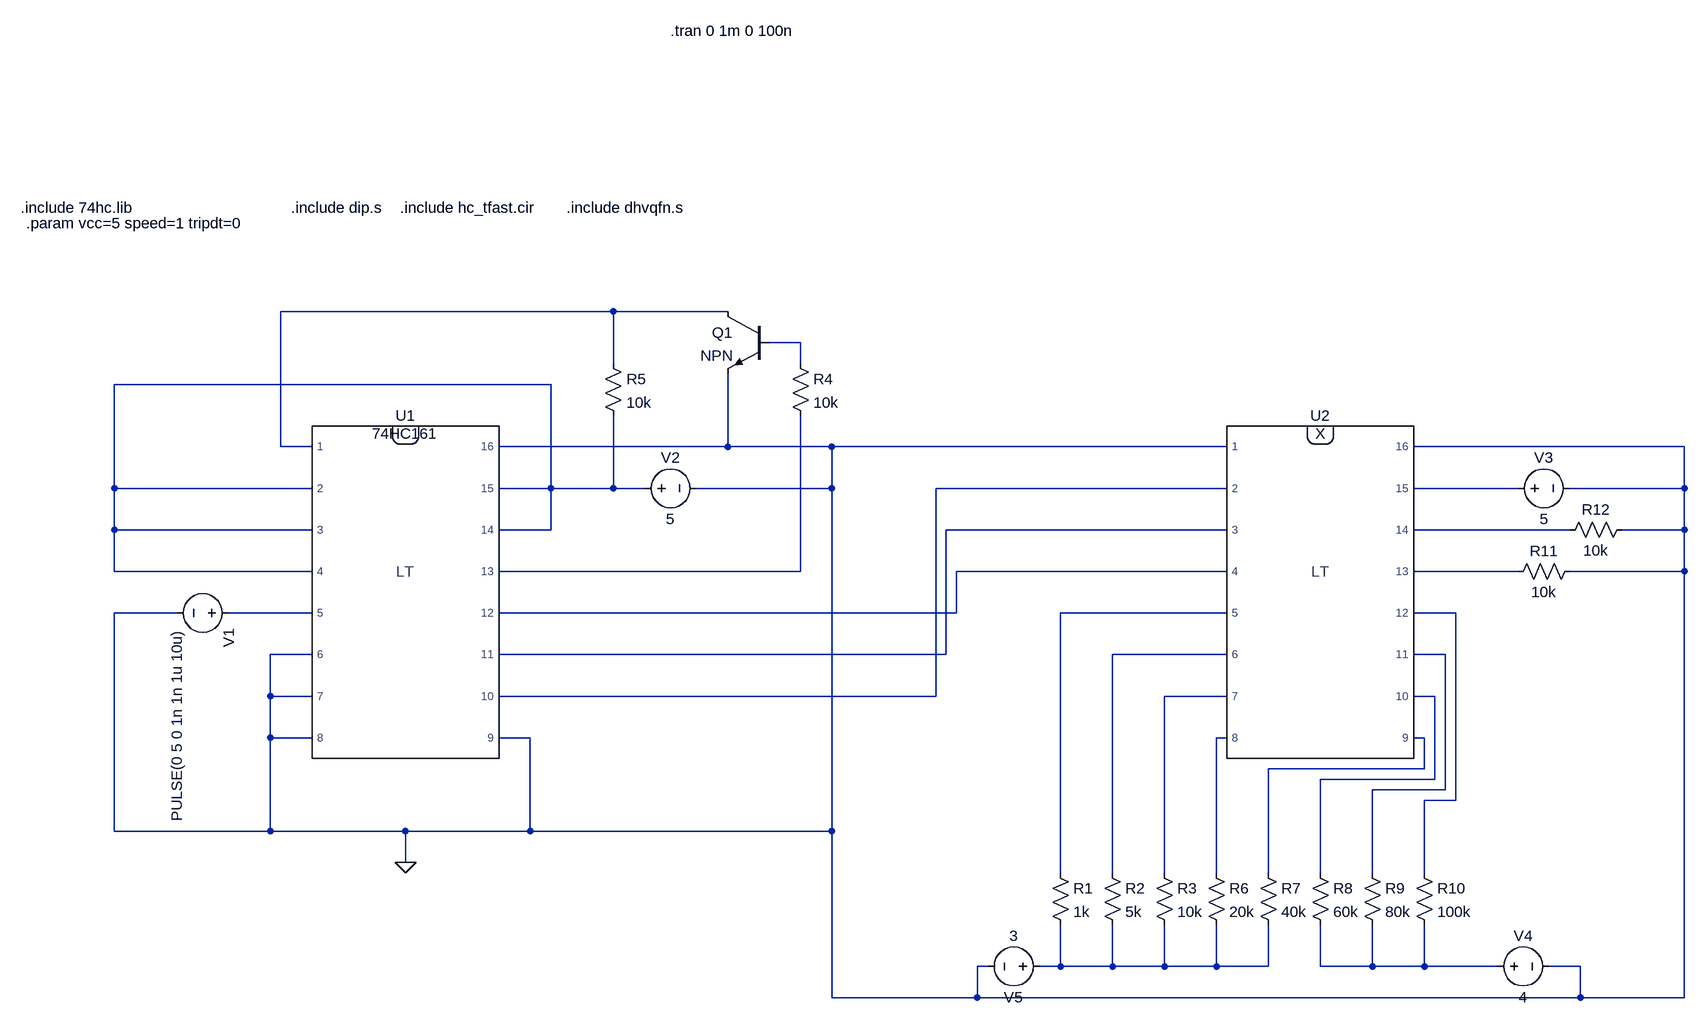
[diagram p0: schematic BinaryCounter.asc]
BinaryCounter.asc, the LTspice schematic file:
Version 4.1
SHEET 1 2248 848
WIRE 592 -224 80 -224
WIRE 768 -224 592 -224
WIRE 880 -176 832 -176
WIRE 592 -144 592 -224
WIRE 880 -144 880 -176
WIRE 496 -112 -176 -112
WIRE 80 -16 80 -224
WIRE 128 -16 80 -16
WIRE 768 -16 768 -128
WIRE 768 -16 416 -16
WIRE 928 -16 768 -16
WIRE 1536 -16 928 -16
WIRE 2240 -16 1824 -16
WIRE -176 48 -176 -112
WIRE 128 48 -176 48
WIRE 496 48 496 -112
WIRE 496 48 416 48
WIRE 592 48 592 -64
WIRE 592 48 496 48
WIRE 640 48 592 48
WIRE 928 48 928 -16
WIRE 928 48 720 48
WIRE 1536 48 1088 48
WIRE 1984 48 1824 48
WIRE 2240 48 2240 -16
WIRE 2240 48 2064 48
WIRE -176 112 -176 48
WIRE 128 112 -176 112
WIRE 496 112 496 48
WIRE 496 112 416 112
WIRE 1536 112 1104 112
WIRE 2064 112 1824 112
WIRE 2240 112 2240 48
WIRE 2240 112 2144 112
WIRE -176 176 -176 112
WIRE 128 176 -176 176
WIRE 880 176 880 -64
WIRE 880 176 416 176
WIRE 1536 176 1120 176
WIRE 1984 176 1824 176
WIRE 2240 176 2240 112
WIRE 2240 176 2064 176
WIRE -80 240 -176 240
WIRE 128 240 0 240
WIRE 1120 240 1120 176
WIRE 1120 240 416 240
WIRE 1536 240 1280 240
WIRE 1888 240 1824 240
WIRE 128 304 64 304
WIRE 1104 304 1104 112
WIRE 1104 304 416 304
WIRE 1536 304 1360 304
WIRE 1872 304 1824 304
WIRE 64 368 64 304
WIRE 128 368 64 368
WIRE 1088 368 1088 48
WIRE 1088 368 416 368
WIRE 1536 368 1440 368
WIRE 1856 368 1824 368
WIRE 64 432 64 368
WIRE 128 432 64 432
WIRE 464 432 416 432
WIRE 1536 432 1520 432
WIRE 1840 432 1824 432
WIRE 1840 480 1840 432
WIRE 1840 480 1600 480
WIRE 1856 496 1856 368
WIRE 1856 496 1680 496
WIRE 1872 512 1872 304
WIRE 1872 512 1760 512
WIRE 1888 528 1888 240
WIRE 1888 528 1840 528
WIRE -176 576 -176 240
WIRE 64 576 64 432
WIRE 64 576 -176 576
WIRE 272 576 64 576
WIRE 464 576 464 432
WIRE 464 576 272 576
WIRE 928 576 928 48
WIRE 928 576 464 576
WIRE 272 624 272 576
WIRE 1280 640 1280 240
WIRE 1360 640 1360 304
WIRE 1440 640 1440 368
WIRE 1520 640 1520 432
WIRE 1600 640 1600 480
WIRE 1680 640 1680 496
WIRE 1760 640 1760 512
WIRE 1840 640 1840 528
WIRE 1168 784 1152 784
WIRE 1280 784 1280 720
WIRE 1280 784 1248 784
WIRE 1360 784 1360 720
WIRE 1360 784 1280 784
WIRE 1440 784 1440 720
WIRE 1440 784 1360 784
WIRE 1520 784 1520 720
WIRE 1520 784 1440 784
WIRE 1600 784 1600 720
WIRE 1600 784 1520 784
WIRE 1680 784 1680 720
WIRE 1760 784 1760 720
WIRE 1760 784 1680 784
WIRE 1840 784 1840 720
WIRE 1840 784 1760 784
WIRE 1952 784 1840 784
WIRE 2080 784 2032 784
WIRE 928 832 928 576
WIRE 1152 832 1152 784
WIRE 1152 832 928 832
WIRE 2080 832 2080 784
WIRE 2080 832 1152 832
WIRE 2240 832 2240 176
WIRE 2240 832 2080 832
FLAG 272 624 0
SYMBOL Misc\\DIP16 272 80 R0
WINDOW 3 0 -116 Center 2
SYMATTR InstName U1
SYMATTR SpiceModel 74HC161
SYMATTR Value 74HC161
SYMBOL voltage 16 240 R90
WINDOW 123 0 0 Left 0
WINDOW 39 0 0 Left 0
SYMATTR InstName V1
SYMATTR Value PULSE(0 5 0 1n 1n 1u 10u)
SYMBOL voltage 624 48 R270
WINDOW 0 32 56 VTop 2
WINDOW 3 -32 56 VBottom 2
WINDOW 123 0 0 Left 0
WINDOW 39 0 0 Left 0
SYMATTR InstName V2
SYMATTR Value 5
SYMBOL npn 832 -224 M0
SYMATTR InstName Q1
SYMBOL res 864 -160 R0
SYMATTR InstName R4
SYMATTR Value 10k
SYMBOL res 576 -160 R0
SYMATTR InstName R5
SYMATTR Value 10k
SYMBOL Misc\\DIP16 1680 80 R0
WINDOW 3 0 -116 Center 2
SYMATTR InstName U2
SYMATTR Value X
SYMATTR SpiceModel 74HC151
SYMBOL res 1264 624 R0
SYMATTR InstName R1
SYMATTR Value 1k
SYMBOL res 1344 624 R0
SYMATTR InstName R2
SYMATTR Value 5k
SYMBOL res 1424 624 R0
SYMATTR InstName R3
SYMATTR Value 10k
SYMBOL res 1504 624 R0
SYMATTR InstName R6
SYMATTR Value 20k
SYMBOL res 1584 624 R0
SYMATTR InstName R7
SYMATTR Value 40k
SYMBOL res 1664 624 R0
SYMATTR InstName R8
SYMATTR Value 60k
SYMBOL res 1744 624 R0
SYMATTR InstName R9
SYMATTR Value 80k
SYMBOL res 1824 624 R0
SYMATTR InstName R10
SYMATTR Value 100k
SYMBOL voltage 1968 48 R270
WINDOW 0 32 56 VTop 2
WINDOW 3 -32 56 VBottom 2
WINDOW 123 0 0 Left 0
WINDOW 39 0 0 Left 0
SYMATTR InstName V3
SYMATTR Value 5
SYMBOL res 2080 160 R90
WINDOW 0 0 56 VBottom 2
WINDOW 3 32 56 VTop 2
SYMATTR InstName R11
SYMATTR Value 10k
SYMBOL res 2160 96 R90
WINDOW 0 0 56 VBottom 2
WINDOW 3 32 56 VTop 2
SYMATTR InstName R12
SYMATTR Value 10k
SYMBOL voltage 1936 784 R270
WINDOW 0 32 56 VTop 2
WINDOW 3 -32 56 VBottom 2
WINDOW 123 0 0 Left 0
WINDOW 39 0 0 Left 0
SYMATTR InstName V4
SYMATTR Value 4
SYMBOL voltage 1264 784 R90
WINDOW 0 32 56 VTop 2
WINDOW 3 -32 56 VBottom 2
WINDOW 123 0 0 Left 0
WINDOW 39 0 0 Left 0
SYMATTR InstName V5
SYMATTR Value 3
TEXT -320 -384 Left 2 !.include 74hc.lib
TEXT 680 -656 Left 2 !.tran 0 1m 0 100n
TEXT -312 -360 Left 2 !.param vcc=5 speed=1 tripdt=0
TEXT 96 -384 Left 2 !.include dip.s
TEXT 264 -384 Left 2 !.include hc_tfast.cir
TEXT 520 -384 Left 2 !.include dhvqfn.s

The netlist it stands for:
* BinaryCounter.asc
X§U1 N001 N003 N003 N003 N011 0 0 0 0 N004 N006 N009 N008 N003 N003 0 74HC161 74HC161  ; pins 1 2 3 4 5 6 7 8 9 10 11 12 13 14 15 16
V1 N011 0 PULSE(0 5 0 1n 1n 1u 10u)
V2 N003 0 5
Q1 N001 N002 0 0 NPN
R4 N002 N008 10k
R5 N001 N003 10k
X§U2 0 N004 N006 N009 N012 N014 N016 N018 N019 N017 N015 N013 N010 N007 N005 0 74HC151 X  ; pins 1 2 3 4 5 6 7 8 9 10 11 12 13 14 15 16
R1 N012 N020 1k
R2 N014 N020 5k
R3 N016 N020 10k
R6 N018 N020 20k
R7 N019 N020 40k
R8 N017 N021 60k
R9 N015 N021 80k
R10 N013 N021 100k
V3 N005 0 5
R11 0 N010 10k
R12 0 N007 10k
V4 N021 0 4
V5 N020 0 3
.model NPN NPN
.model PNP PNP
.lib standard.bjt
.include 74hc.lib
.tran 0 1m 0 100n
.param vcc=5 speed=1 tripdt=0
.include dip.s
.include hc_tfast.cir
.include dhvqfn.s
.backanno
.end